# EAGLE schematic SCHEMATIC_EP (EAGLE 9.6.2)
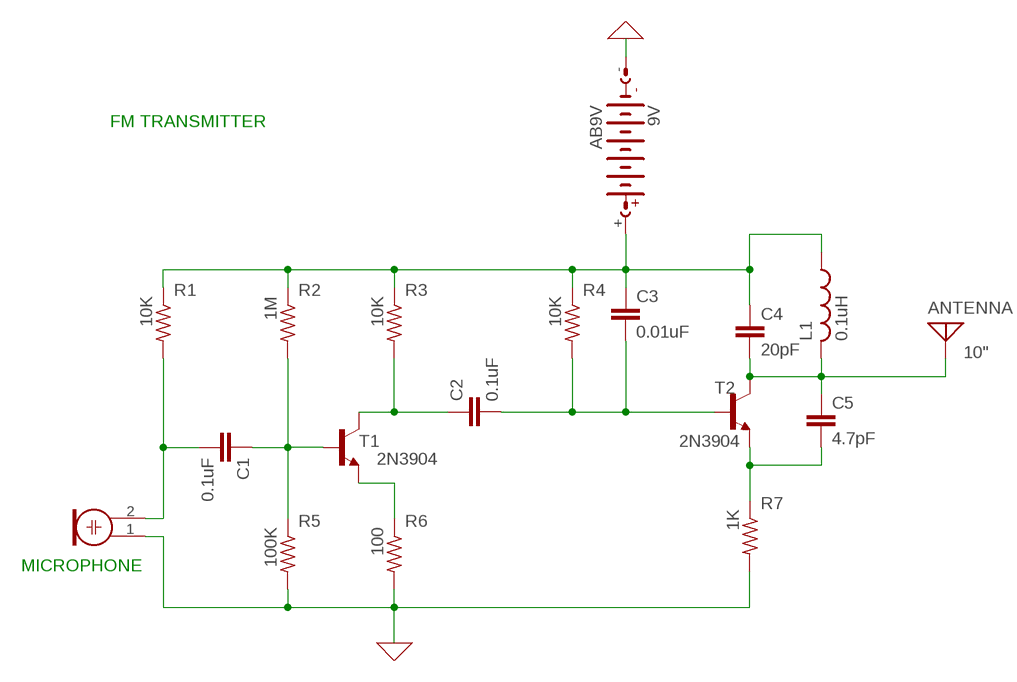
[diagram p0: schematic, sheet 1]

## Parts
9V  AB9V  [AB9V]
ANTENNA  10"  ANTENNA  [PAD-01]
C1  0.1uF  C2.5/2  [C2.5-2]
C2  0.1uF  C2.5/2  [C2.5-2]
C3  0.01uF  C2.5/2  [C2.5-2]
C4  20pF  C2.5/2  [C2.5-2]
C5  4.7pF  C2.5/2  [C2.5-2]
L1  0.1uH  L-US0207/7  [0207/7]
MICROPHONE  ELECTRET_MICROPHON-F6050AP  [F6050AP]
R1  10K  R-US_R0603  [R0603]
R2  1M  R-US_R0603  [R0603]
R3  10K  R-US_R0603  [R0603]
R4  10K  R-US_R0603  [R0603]
R5  100K  R-US_R0603  [R0603]
R6  100  R-US_R0603  [R0603]
R7  1K  R-US_R0603  [R0603]
T1  2N3904  [TO92]
T2  2N3904  [TO92]

## Nets
0: 9V.- MICROPHONE.1 R5.2 R6.2 R7.2 ; supply symbol labelled GND
N$1: C1.1 R2.2 R5.1 T1.2(B)
N$2: R6.1 T1.3(E)
N$3: C2.1 R3.2 T1.1(C)
N$4: 9V.+ C3.1 C4.1 L1.1 R1.1 R2.1 R3.1 R4.1
N$5: C1.2 MICROPHONE.2 R1.2
N$7: C5.2 R7.1 T2.3(E)
N$8: C2.2 C3.2 R4.2 T2.2(B)
N$9: ANTENNA.1 C4.2 C5.1 L1.2 T2.1(C)

## Notes on the sheet
- FM TRANSMITTER
- MICROPHONE

## Library data of the parts
9V = battery:AB9V: 9-V BATTERY CLIP
ANTENNA = discrete:ANTENNA: Antenna
C1-C5 = capacitor-wima:C: CAPACITOR naming: grid - package width
L1 = rcl:L-US: INDUCTOR, American symbol; SPICEPREFIX: L
MICROPHONE = microphon:ELECTRET_MICROPHON-: Electret Condenser Microphone
R1-R7 = rcl:R-US_: RESISTOR, American symbol; SPICEPREFIX: R
T1 T2 = transistor:2N3904: NPN TRANSISTOR